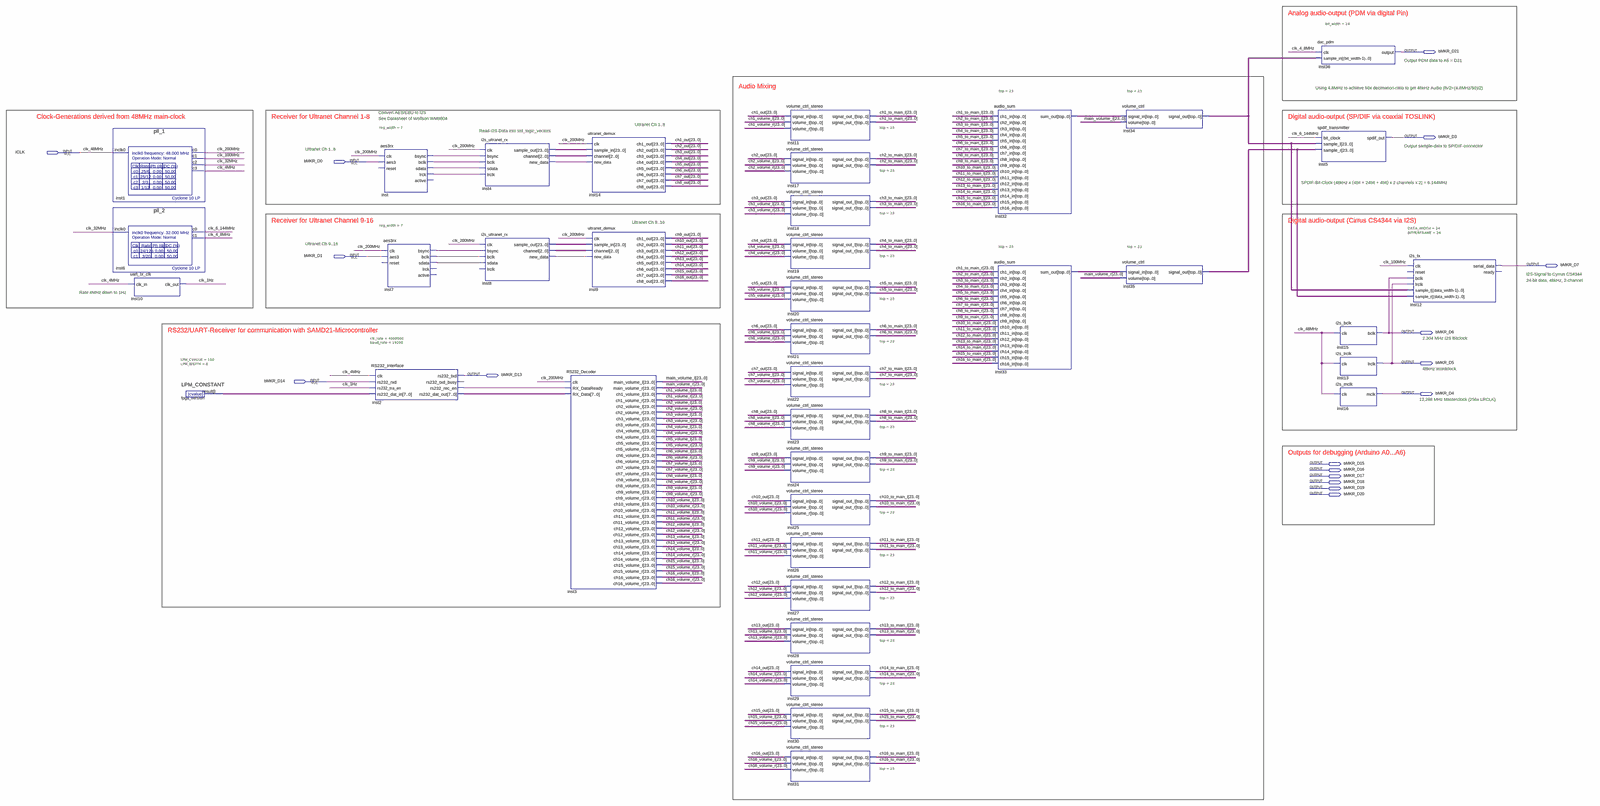
[diagram p0: schematic sheet, whole]
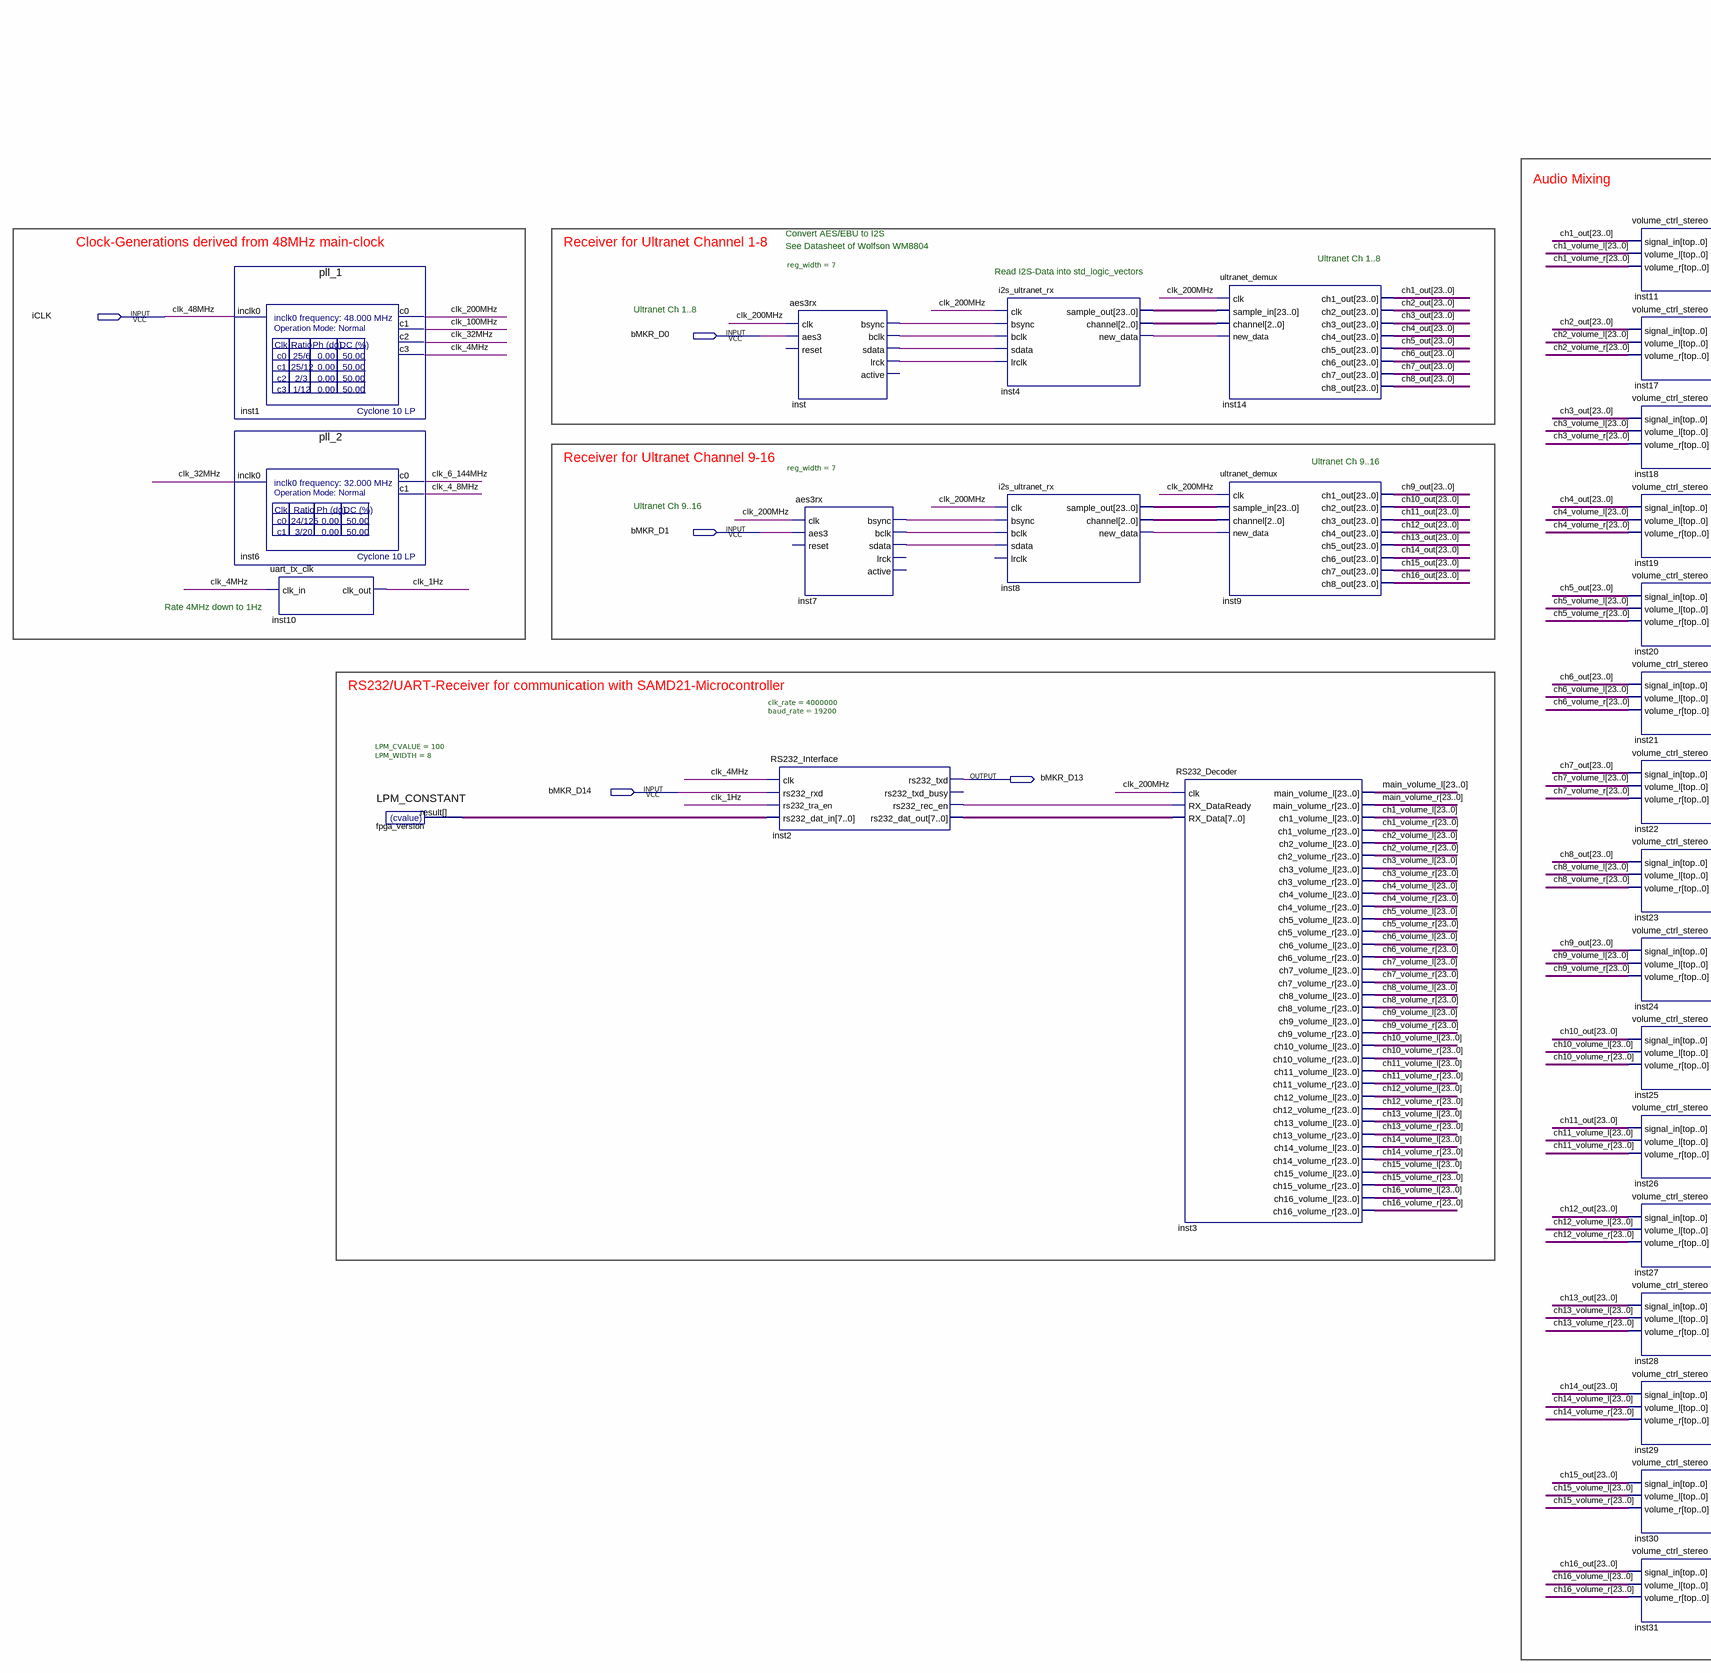
[diagram p1: schematic sheet, left part]
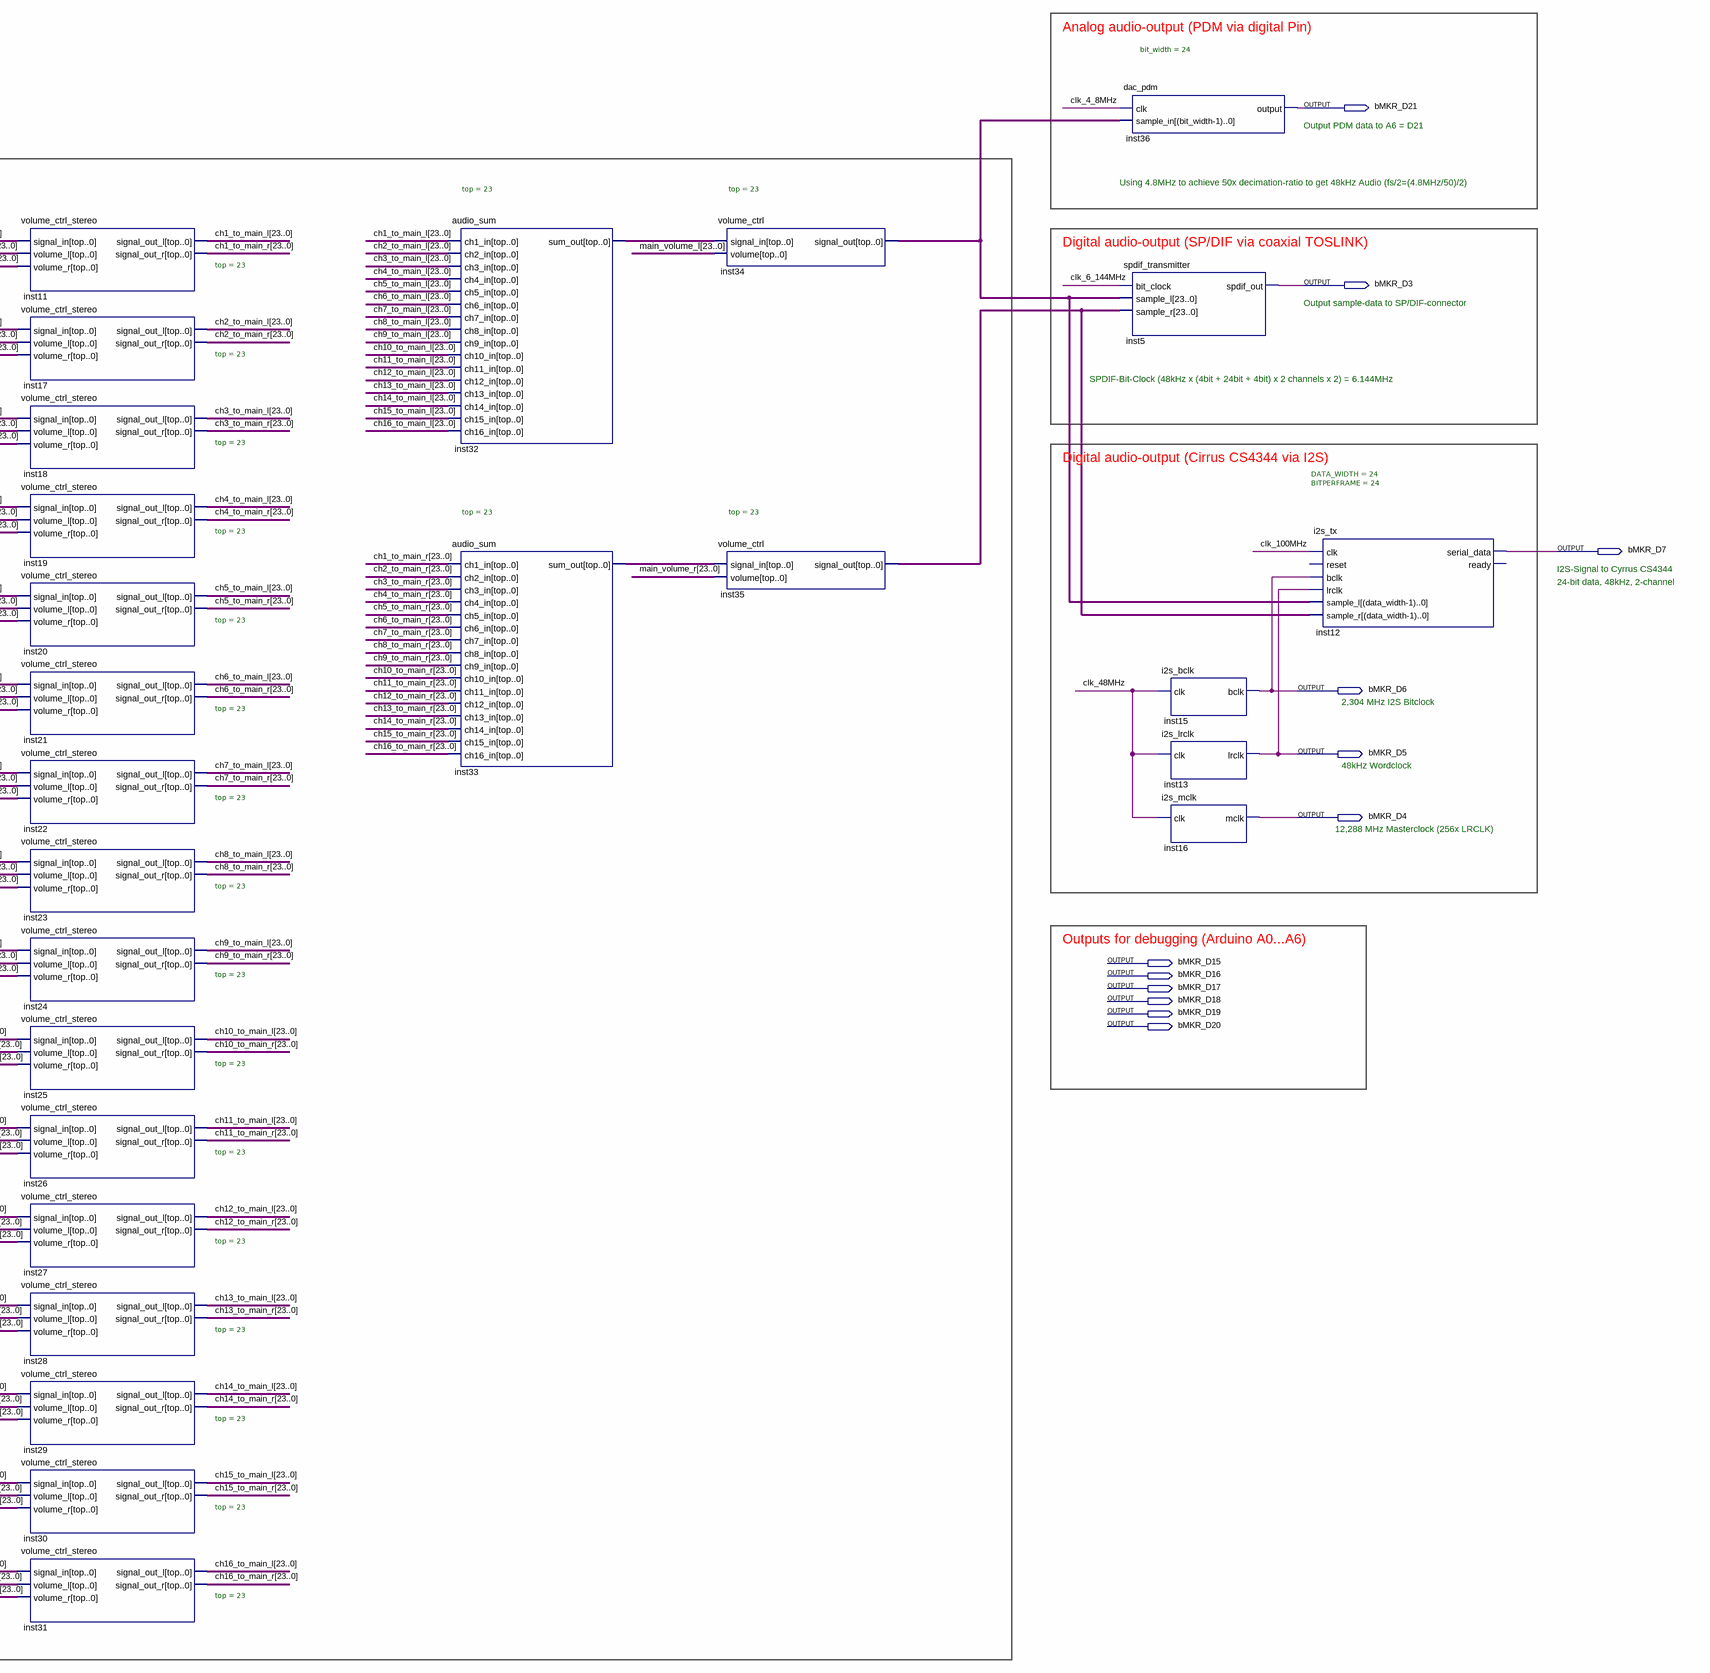
[diagram p2: schematic sheet, right part]
// Quartus schematic UltranetReceiver.bdf as structural Verilog: 38 symbols, 17 pins
module UltranetReceiver (
  input  iCLK,
  input  bMKR_D0,
  input  bMKR_D1,
  input  bMKR_D14,
  output bMKR_D21,
  output bMKR_D3,
  output bMKR_D7,
  output bMKR_D6,
  output bMKR_D5,
  output bMKR_D13,
  output bMKR_D4,
  output bMKR_D15,
  output bMKR_D16,
  output bMKR_D17,
  output bMKR_D18,
  output bMKR_D19,
  output bMKR_D20
);

  wire clk_1Hz, clk_4_8MHz, clk_4MHz, clk_6_144MHz, clk_32MHz, clk_100MHz, clk_200MHz, inst2_rs232_rec_en,
       inst4_new_data, inst7_bclk, inst7_bsync, inst7_sdata, inst8_new_data, inst_bclk, inst_bsync,
       inst_lrck, inst_sdata;
  wire [2:0] inst4_channel, inst8_channel;
  wire [7:0] fpga_version_result, inst2_rs232_dat_out;
  wire [23:0] ch1_out, ch1_to_main_l, ch1_to_main_r, ch1_volume_l, ch1_volume_r, ch2_out, ch2_to_main_l,
       ch2_to_main_r, ch2_volume_l, ch2_volume_r, ch3_out, ch3_to_main_l, ch3_to_main_r, ch3_volume_l,
       ch3_volume_r, ch4_out, ch4_to_main_l, ch4_to_main_r, ch4_volume_l, ch4_volume_r, ch5_out,
       ch5_to_main_l, ch5_to_main_r, ch5_volume_l, ch5_volume_r, ch6_out, ch6_to_main_l, ch6_to_main_r,
       ch6_volume_l, ch6_volume_r, ch7_out, ch7_to_main_l, ch7_to_main_r, ch7_volume_l, ch7_volume_r,
       ch8_out, ch8_to_main_l, ch8_to_main_r, ch8_volume_l, ch8_volume_r, ch9_out, ch9_to_main_l,
       ch9_to_main_r, ch9_volume_l, ch9_volume_r, ch10_out, ch10_to_main_l, ch10_to_main_r, ch10_volume_l,
       ch10_volume_r, ch11_out, ch11_to_main_l, ch11_to_main_r, ch11_volume_l, ch11_volume_r, ch12_out,
       ch12_to_main_l, ch12_to_main_r, ch12_volume_l, ch12_volume_r, ch13_out, ch13_to_main_l,
       ch13_to_main_r, ch13_volume_l, ch13_volume_r, ch14_out, ch14_to_main_l, ch14_to_main_r, ch14_volume_l,
       ch14_volume_r, ch15_out, ch15_to_main_l, ch15_to_main_r, ch15_volume_l, ch15_volume_r, ch16_out,
       ch16_to_main_l, ch16_to_main_r, ch16_volume_l, ch16_volume_r, inst4_sample_out, inst8_sample_out,
       inst32_sum_out, inst33_sum_out, inst34_signal_out, inst35_signal_out, main_volume_l, main_volume_r;

  pll_1 inst1 (.inclk0(iCLK), .c0(clk_200MHz), .c1(clk_100MHz), .c2(clk_32MHz), .c3(clk_4MHz));
  pll_2 inst6 (.inclk0(clk_32MHz), .c0(clk_6_144MHz), .c1(clk_4_8MHz));
  uart_tx_clk inst10 (.clk_in(clk_4MHz), .clk_out(clk_1Hz));
  LPM_CONSTANT #(.LPM_CVALUE(100), .LPM_WIDTH(8)) fpga_version (.result(fpga_version_result));
  aes3rx #(.reg_width(7)) inst (
    .clk(clk_200MHz), .aes3(bMKR_D0), .bsync(inst_bsync), .bclk(inst_bclk), .sdata(inst_sdata),
    .lrck(inst_lrck));  // open: reset, active
  aes3rx #(.reg_width(7)) inst7 (
    .clk(clk_200MHz), .aes3(bMKR_D1), .bsync(inst7_bsync), .bclk(inst7_bclk), .sdata(inst7_sdata));  // open: reset, lrck, active
  RS232_Interface #(.clk_rate(4000000), .baud_rate(19200)) inst2 (
    .clk(clk_4MHz), .rs232_rxd(bMKR_D14), .rs232_tra_en(clk_1Hz), .rs232_dat_in(fpga_version_result),
    .rs232_txd(bMKR_D13), .rs232_rec_en(inst2_rs232_rec_en), .rs232_dat_out(inst2_rs232_dat_out));  // open: rs232_txd_busy
  i2s_ultranet_rx inst4 (
    .clk(clk_200MHz), .bsync(inst_bsync), .bclk(inst_bclk), .sdata(inst_sdata), .lrclk(inst_lrck),
    .sample_out(inst4_sample_out), .channel(inst4_channel), .new_data(inst4_new_data));
  i2s_ultranet_rx inst8 (
    .clk(clk_200MHz), .bsync(inst7_bsync), .bclk(inst7_bclk), .sdata(inst7_sdata),
    .sample_out(inst8_sample_out), .channel(inst8_channel), .new_data(inst8_new_data));  // open: lrclk
  RS232_Decoder inst3 (
    .clk(clk_200MHz), .RX_DataReady(inst2_rs232_rec_en), .RX_Data(inst2_rs232_dat_out),
    .main_volume_l(main_volume_l), .main_volume_r(main_volume_r), .ch1_volume_l(ch1_volume_l),
    .ch1_volume_r(ch1_volume_r), .ch2_volume_l(ch2_volume_l), .ch2_volume_r(ch2_volume_r),
    .ch3_volume_l(ch3_volume_l), .ch3_volume_r(ch3_volume_r), .ch4_volume_l(ch4_volume_l),
    .ch4_volume_r(ch4_volume_r), .ch5_volume_l(ch5_volume_l), .ch5_volume_r(ch5_volume_r),
    .ch6_volume_l(ch6_volume_l), .ch6_volume_r(ch6_volume_r), .ch7_volume_l(ch7_volume_l),
    .ch7_volume_r(ch7_volume_r), .ch8_volume_l(ch8_volume_l), .ch8_volume_r(ch8_volume_r),
    .ch9_volume_l(ch9_volume_l), .ch9_volume_r(ch9_volume_r), .ch10_volume_l(ch10_volume_l),
    .ch10_volume_r(ch10_volume_r), .ch11_volume_l(ch11_volume_l), .ch11_volume_r(ch11_volume_r),
    .ch12_volume_l(ch12_volume_l), .ch12_volume_r(ch12_volume_r), .ch13_volume_l(ch13_volume_l),
    .ch13_volume_r(ch13_volume_r), .ch14_volume_l(ch14_volume_l), .ch14_volume_r(ch14_volume_r),
    .ch15_volume_l(ch15_volume_l), .ch15_volume_r(ch15_volume_r), .ch16_volume_l(ch16_volume_l),
    .ch16_volume_r(ch16_volume_r));
  ultranet_demux inst14 (
    .clk(clk_200MHz), .sample_in(inst4_sample_out), .channel(inst4_channel), .new_data(inst4_new_data),
    .ch1_out(ch1_out), .ch2_out(ch2_out), .ch3_out(ch3_out), .ch4_out(ch4_out), .ch5_out(ch5_out),
    .ch6_out(ch6_out), .ch7_out(ch7_out), .ch8_out(ch8_out));
  ultranet_demux inst9 (
    .clk(clk_200MHz), .sample_in(inst8_sample_out), .channel(inst8_channel), .new_data(inst8_new_data),
    .ch1_out(ch9_out), .ch2_out(ch10_out), .ch3_out(ch11_out), .ch4_out(ch12_out), .ch5_out(ch13_out),
    .ch6_out(ch14_out), .ch7_out(ch15_out), .ch8_out(ch16_out));
  volume_ctrl_stereo #(.top(23)) inst11 (
    .signal_in(ch1_out), .volume_l(ch1_volume_l), .volume_r(ch1_volume_r), .signal_out_l(ch1_to_main_l),
    .signal_out_r(ch1_to_main_r));
  volume_ctrl_stereo #(.top(23)) inst17 (
    .signal_in(ch2_out), .volume_l(ch2_volume_l), .volume_r(ch2_volume_r), .signal_out_l(ch2_to_main_l),
    .signal_out_r(ch2_to_main_r));
  volume_ctrl_stereo #(.top(23)) inst18 (
    .signal_in(ch3_out), .volume_l(ch3_volume_l), .volume_r(ch3_volume_r), .signal_out_l(ch3_to_main_l),
    .signal_out_r(ch3_to_main_r));
  volume_ctrl_stereo #(.top(23)) inst19 (
    .signal_in(ch4_out), .volume_l(ch4_volume_l), .volume_r(ch4_volume_r), .signal_out_l(ch4_to_main_l),
    .signal_out_r(ch4_to_main_r));
  volume_ctrl_stereo #(.top(23)) inst20 (
    .signal_in(ch5_out), .volume_l(ch5_volume_l), .volume_r(ch5_volume_r), .signal_out_l(ch5_to_main_l),
    .signal_out_r(ch5_to_main_r));
  volume_ctrl_stereo #(.top(23)) inst21 (
    .signal_in(ch6_out), .volume_l(ch6_volume_l), .volume_r(ch6_volume_r), .signal_out_l(ch6_to_main_l),
    .signal_out_r(ch6_to_main_r));
  volume_ctrl_stereo #(.top(23)) inst22 (
    .signal_in(ch7_out), .volume_l(ch7_volume_l), .volume_r(ch7_volume_r), .signal_out_l(ch7_to_main_l),
    .signal_out_r(ch7_to_main_r));
  volume_ctrl_stereo #(.top(23)) inst23 (
    .signal_in(ch8_out), .volume_l(ch8_volume_l), .volume_r(ch8_volume_r), .signal_out_l(ch8_to_main_l),
    .signal_out_r(ch8_to_main_r));
  volume_ctrl_stereo #(.top(23)) inst24 (
    .signal_in(ch9_out), .volume_l(ch9_volume_l), .volume_r(ch9_volume_r), .signal_out_l(ch9_to_main_l),
    .signal_out_r(ch9_to_main_r));
  volume_ctrl_stereo #(.top(23)) inst25 (
    .signal_in(ch10_out), .volume_l(ch10_volume_l), .volume_r(ch10_volume_r), .signal_out_l(ch10_to_main_l),
    .signal_out_r(ch10_to_main_r));
  volume_ctrl_stereo #(.top(23)) inst26 (
    .signal_in(ch11_out), .volume_l(ch11_volume_l), .volume_r(ch11_volume_r), .signal_out_l(ch11_to_main_l),
    .signal_out_r(ch11_to_main_r));
  volume_ctrl_stereo #(.top(23)) inst27 (
    .signal_in(ch12_out), .volume_l(ch12_volume_l), .volume_r(ch12_volume_r), .signal_out_l(ch12_to_main_l),
    .signal_out_r(ch12_to_main_r));
  volume_ctrl_stereo #(.top(23)) inst28 (
    .signal_in(ch13_out), .volume_l(ch13_volume_l), .volume_r(ch13_volume_r), .signal_out_l(ch13_to_main_l),
    .signal_out_r(ch13_to_main_r));
  volume_ctrl_stereo #(.top(23)) inst29 (
    .signal_in(ch14_out), .volume_l(ch14_volume_l), .volume_r(ch14_volume_r), .signal_out_l(ch14_to_main_l),
    .signal_out_r(ch14_to_main_r));
  volume_ctrl_stereo #(.top(23)) inst30 (
    .signal_in(ch15_out), .volume_l(ch15_volume_l), .volume_r(ch15_volume_r), .signal_out_l(ch15_to_main_l),
    .signal_out_r(ch15_to_main_r));
  volume_ctrl_stereo #(.top(23)) inst31 (
    .signal_in(ch16_out), .volume_l(ch16_volume_l), .volume_r(ch16_volume_r), .signal_out_l(ch16_to_main_l),
    .signal_out_r(ch16_to_main_r));
  audio_sum #(.top(23)) inst32 (
    .ch1_in(ch1_to_main_l), .ch2_in(ch2_to_main_l), .ch3_in(ch3_to_main_l), .ch4_in(ch4_to_main_l),
    .ch5_in(ch5_to_main_l), .ch6_in(ch6_to_main_l), .ch7_in(ch7_to_main_l), .ch8_in(ch8_to_main_l),
    .ch9_in(ch9_to_main_l), .ch10_in(ch10_to_main_l), .ch11_in(ch11_to_main_l), .ch12_in(ch12_to_main_l),
    .ch13_in(ch13_to_main_l), .ch14_in(ch14_to_main_l), .ch15_in(ch15_to_main_l), .ch16_in(ch16_to_main_l),
    .sum_out(inst32_sum_out));
  audio_sum #(.top(23)) inst33 (
    .ch1_in(ch1_to_main_r), .ch2_in(ch2_to_main_r), .ch3_in(ch3_to_main_r), .ch4_in(ch4_to_main_r),
    .ch5_in(ch5_to_main_r), .ch6_in(ch6_to_main_r), .ch7_in(ch7_to_main_r), .ch8_in(ch8_to_main_r),
    .ch9_in(ch9_to_main_r), .ch10_in(ch10_to_main_r), .ch11_in(ch11_to_main_r), .ch12_in(ch12_to_main_r),
    .ch13_in(ch13_to_main_r), .ch14_in(ch14_to_main_r), .ch15_in(ch15_to_main_r), .ch16_in(ch16_to_main_r),
    .sum_out(inst33_sum_out));
  volume_ctrl #(.top(23)) inst34 (.signal_in(inst32_sum_out), .volume(main_volume_l), .signal_out(inst34_signal_out));
  volume_ctrl #(.top(23)) inst35 (.signal_in(inst33_sum_out), .volume(main_volume_r), .signal_out(inst35_signal_out));
  dac_pdm #(.bit_width(24)) inst36 (.clk(clk_4_8MHz), .sample_in(inst34_signal_out), .\output (bMKR_D21));
  spdif_transmitter inst5 (
    .bit_clock(clk_6_144MHz), .sample_l(inst34_signal_out), .sample_r(inst35_signal_out), .spdif_out(bMKR_D3));
  i2s_bclk inst15 (.clk(iCLK), .bclk(bMKR_D6));
  i2s_lrclk inst13 (.clk(iCLK), .lrclk(bMKR_D5));
  i2s_mclk inst16 (.clk(iCLK), .mclk(bMKR_D4));
  i2s_tx #(.DATA_WIDTH(24), .BITPERFRAME(24)) inst12 (
    .clk(clk_100MHz), .bclk(bMKR_D6), .lrclk(bMKR_D5), .sample_l(inst34_signal_out),
    .sample_r(inst35_signal_out), .serial_data(bMKR_D7));  // open: reset, ready

  // Other names for the same wires on the sheet: clk_48MHz = iCLK

  // Notes on the sheet:
  //   Analog audio-output (PDM via digital Pin)
  //   Output PDM data to A6 = D21
  //   Audio Mixing
  //   Using 4.8MHz to achieve 50x decimation-ratio to get 48kHz Audio (fs/2=(4.8MHz/50)/2)
  //   Convert AES/EBU to I2S
  //   Clock-Generations derived from 48MHz main-clock
  //   Receiver for Ultranet Channel 1-8
  //   Digital audio-output (SP/DIF via coaxial TOSLINK)
  //   See Datasheet of Wolfson WM8804
  //   Ultranet Ch 1..8
  //   Read I2S-Data into std_logic_vectors
  //   Output sample-data to SP/DIF-connector
  //   Ultranet Ch 1..8
  //   SPDIF-Bit-Clock (48kHz x (4bit + 24bit + 4bit) x 2 channels x 2) = 6.144MHz
  //   Receiver for Ultranet Channel 9-16
  //   Digital audio-output (Cirrus CS4344 via I2S)
  //   Ultranet Ch 9..16
  //   Ultranet Ch 9..16
  //   I2S-Signal to Cyrrus CS4344
  //   24-bit data, 48kHz, 2-channel
  //   Rate 4MHz down to 1Hz
  //   RS232/UART-Receiver for communication with SAMD21-Microcontroller
  //   2,304 MHz I2S Bitclock
  //   48kHz Wordclock
  //   12,288 MHz Masterclock (256x LRCLK)
  //   Outputs for debugging (Arduino A0...A6)
endmodule
